# EAGLE design 555 (EAGLE 9.6.2)
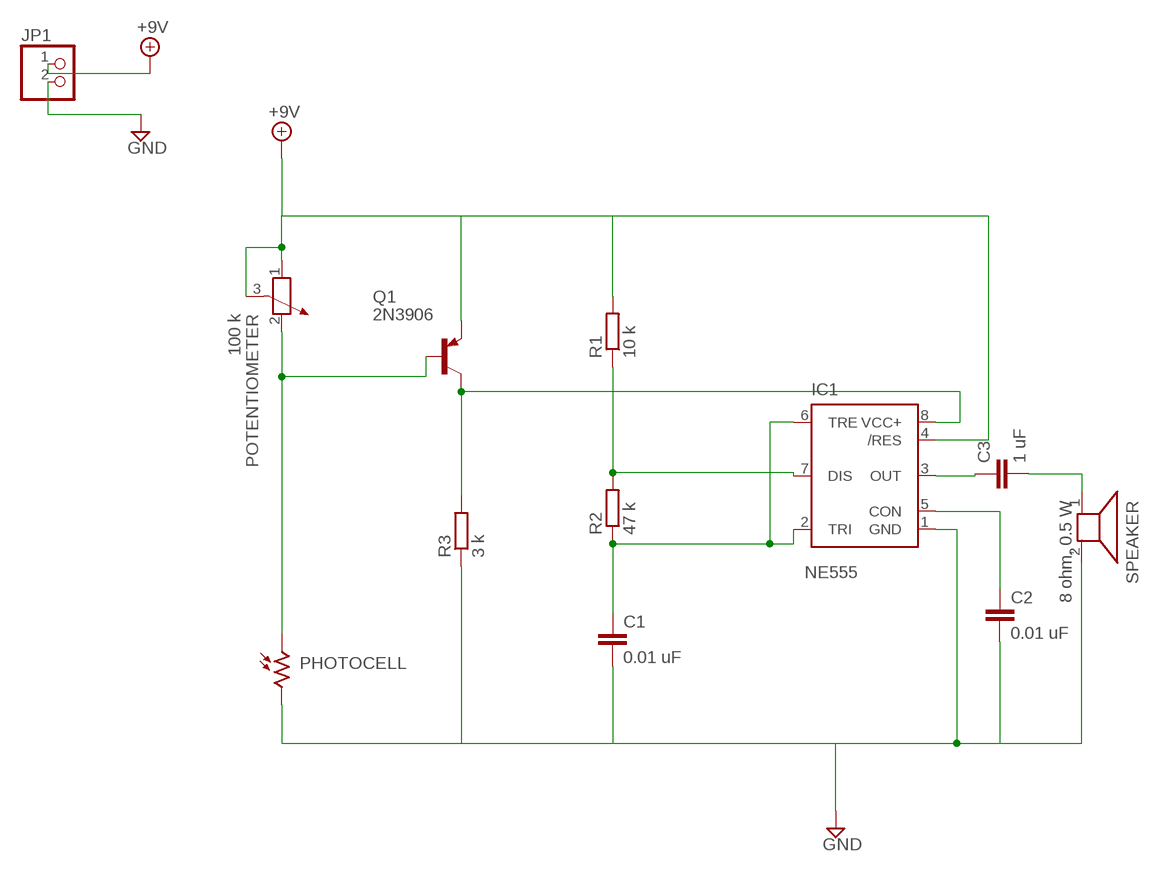
[diagram p0: schematic, sheet 1]

## Parts
C1  0.01 uF  C-EU025-025X050  [C025-025X050]
C2  0.01 uF  C-EU025-025X050  [C025-025X050]
C3  1 uF  C-EU025-025X050  [C025-025X050]
IC1  NE555  [DIL-08]
JP1  PINHD-1X2  [1X02]
PHOTOCELL  PHOTOCELLW55  [W55XX_H]
POTENTIOMETER  100 k  POTENTIOMETER_PT-10  [PT-10]
Q1  2N3906  [TO92]
R1  10 k  R-EU_0204/7  [0204/7]
R2  47 k  R-EU_0204/7  [0204/7]
R3  3 k  R-EU_0204/7  [0204/7]
SPEAKER  8 ohm, 0.5 W  AL60P  [AL60P]

## Nets
+9V: IC1.4(/RES) JP1.1 POTENTIOMETER.1 POTENTIOMETER.3 Q1.3(E) R1.2
GND: C1.2 C2.2 IC1.1(GND) JP1.2 PHOTOCELL.2 R3.1 SPEAKER.2
N$1: C3.1 IC1.3(OUT)
N$2: C3.2 SPEAKER.1
N$4: C2.1 IC1.5(CON)
N$5: IC1.7(DIS) R1.1 R2.2
N$6: C1.1 IC1.2(TRI) R2.1
N$7: IC1.8(VCC+) Q1.1(C) R3.2
N$8: PHOTOCELL.1 POTENTIOMETER.2 Q1.2(B)
N$9: IC1.6(TRE)

## Library data of the parts
C1-C3 = rcl:C-EU: CAPACITOR, European symbol; SPICEPREFIX: C
IC1 = st-microelectronics:NE555: General purpose bipolar Timer; MF: Arrow Electronics; MPN: NE555N; OC_FARNELL: 1467742; OC_NEWARK: 89K1486
JP1 = pinhead:PINHD-1X2: PIN HEADER
PHOTOCELL = photo-elements:PHOTOCELL: Photo Sensor
POTENTIOMETER = rcl:POTENTIOMETER_: Potentiometer; SPICEMODEL: POT; SPICEPREFIX: X
Q1 = transistor-pnp:2N3906: PNP Transistor
R1-R3 = rcl:R-EU_: RESISTOR, European symbol; SPICEPREFIX: R
SPEAKER = buzzer:AL60P: SPEAKER Source: Buerklin; OC_FARNELL: unknown; OC_NEWARK: unknown

## Board
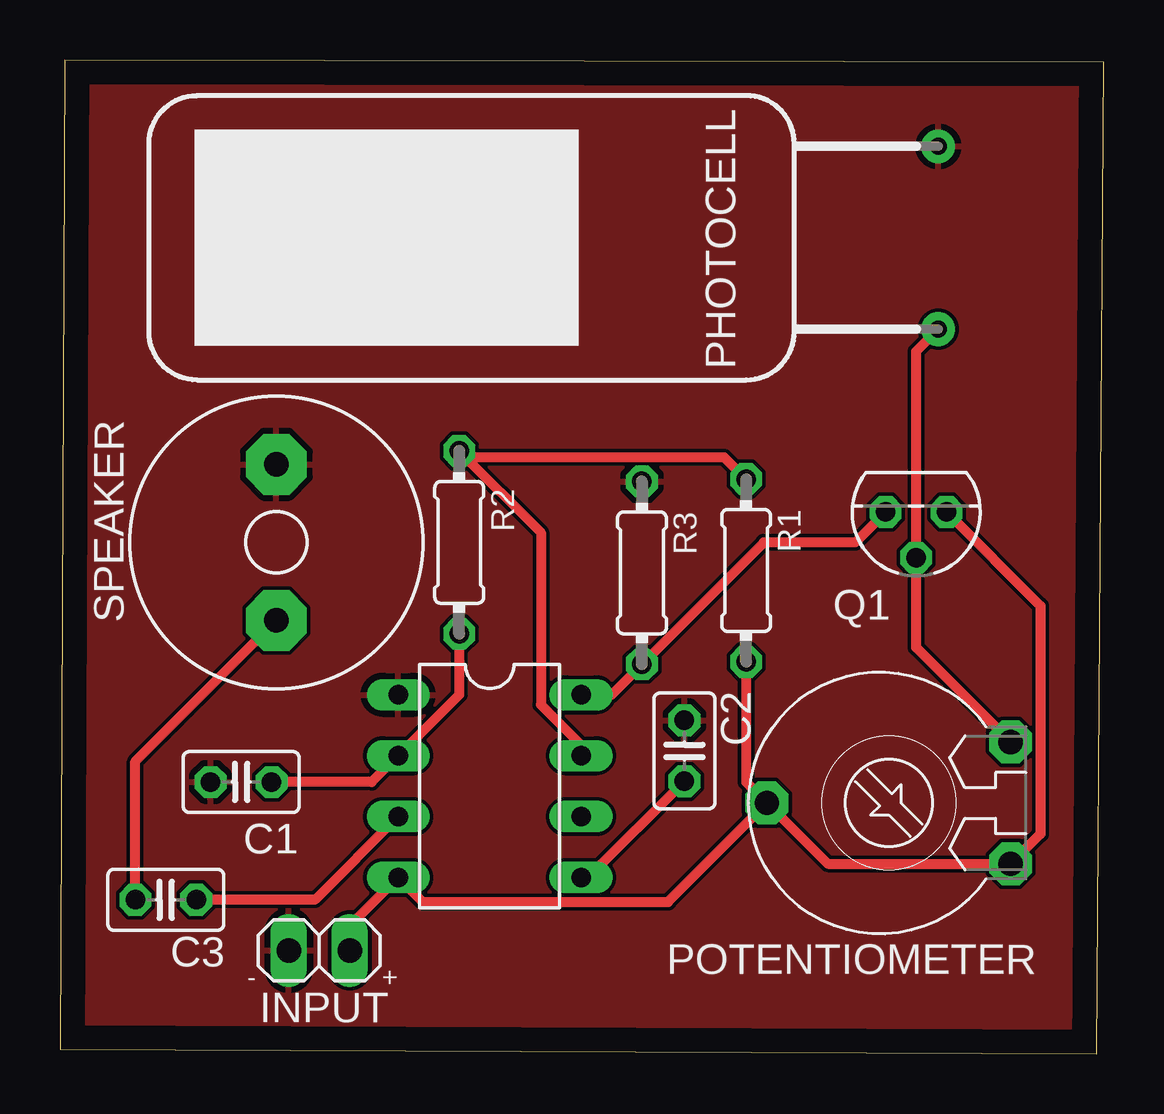
[diagram p1: board, top side]

Size 43.51 x 41.43 mm. Coordinates in mm from the lower left corner, seen from the top.
Outline: 0,0.2 43.21,0 43.51,41.33 0.2,41.43 0,0.2
Copper layers (1*16): Top 0.035mm / dielectric 1.5mm / Bottom 0.035mm
Design rules "default": minimum track width 6mil, minimum drill 0.35mm, track to track 6mil, track to pad 6mil, pad to pad 6mil, via to via 6mil, smd to smd 6mil, copper to edge 40mil, drill to drill 6mil, minimum pad ring 10mil, minimum via ring 8mil, stop-mask expansion 4mil, vias tented up to drill 0mil, thermal gap 10mil

### Footprints (pad centres in the part's own frame; a part is rotated, then mirrored left to right if it is on the bottom)
C025-025X050 = drill 0.813 octagon: 1 -1.27,0; 2 1.27,0
DIL-08 = drill 0.813 long: 1 -3.81,-3.81; 2 -1.27,-3.81; 3 1.27,-3.81; 4 3.81,-3.81; 5 3.81,3.81; 6 1.27,3.81; 7 -1.27,3.81; 8 -3.81,3.81
1X02 = drill 1.016 long: 1 -1.27,0; 2 1.27,0
W55XX_H = drill 0.7 pad 1.4: 1 -3.81,-6; 2 3.81,-6
PT-10 = drill 1.016 pad 1.778 octagon: 1 -2.54,-5.08; 2 2.54,-5.08; 3 0,5.08
TO92 = drill 0.813 octagon: 1 1.27,0; 2 0,1.905; 3 -1.27,0
0204/7 = drill 0.813 octagon: 1 -3.81,0; 2 3.81,0
AL60P = drill 1.016 pad 2.54 octagon: 1 -3.251,0; 2 3.251,0

### Placement (x,y rotation side)
C1  7.55,11.33 180 top
C2  26.03,12.63 90 top
C3  4.41,6.42 180 top
IC1  17.91,11.16 270 top
JP1  10.81,4.31 180 top
PHOTOCELL  30.61,34.02 90 top
POTENTIOMETER  34.55,10.46 90 top
Q1  35.69,22.59 180 top
R1  28.6,20.15 270 top
R2  16.64,21.32 90 top
R3  24.26,20.05 270 top
SPEAKER  9.02,21.32 90 top

### Tracks (layer width: path | path; a pad name or v marks a point on that pad's centre or on a via)
+9V
  Top 0.406: R1.2 28.6,11.33 POTENTIOMETER.3 | POTENTIOMETER.3 32.01,7.92 POTENTIOMETER.1 40.88,9.16 40.88,18.68 Q1.3 | POTENTIOMETER.3 25.34,6.33 15.12,6.33 IC1.4 12.08,5.33 JP1.1
GND
  pour Top: 0,0.2 43.44,0.2 43.44,41.34 0,41.34
N$1
  Top 0.406: C3.1 10.63,6.42 IC1.3
N$2
  Top 0.406: SPEAKER.1 3.14,12.19 C3.2
N$4
  Top 0.406: C2.1 22.02,7.35 IC1.5
N$5
  Top 0.406: R1.1 27.68,24.88 16.89,24.88 R2.2 20.04,21.73 20.04,14.55 21.72,12.87 IC1.7
N$6
  Top 0.406: C1.1 13,11.33 IC1.2 16.64,14.97 R2.1
N$7
  Top 0.406: IC1.8 22.99,14.97 R3.2 29.34,21.32 33.15,21.32 Q1.1
N$8
  Top 0.406: POTENTIOMETER.2 35.69,16.94 Q1.2 35.69,29.29 PHOTOCELL.1

### Text on the board
tNames: - | + | INPUT
bNames: Alarm using photoresistor | & 555 timer